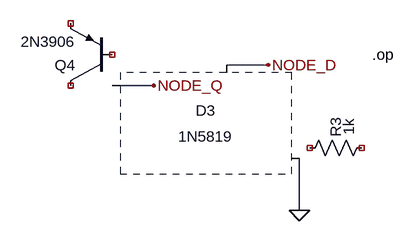
[diagram p0: schematic case_14.asc]
case_14.asc, the LTspice schematic file:
Version 4.1
SHEET 1 880 680
WIRE 272 192 336 192
WIRE 448 160 512 160
WIRE 560 304 560 384
FLAG 336 192 NODE_Q
FLAG 512 160 NODE_D
FLAG 560 384 0
SYMBOL pnp 272 192 R180
SYMATTR InstName Q4
SYMATTR Value 2N3906
SYMATTR Type pnp
SYMBOL Diodes\diode 448 160 M0
SYMATTR InstName D3
SYMATTR Value 1N5819
SYMATTR SpiceLine Ron=0.05
SYMBOL res 560 304 R270
WINDOW 0 32 56 Left 2
SYMATTR InstName R3
SYMATTR Value 1k
TEXT 672 144 Left 2 !.op

The netlist it stands for:
* case_14.asc
Q4 NC_01 NC_02 NC_03 0 2N3906
* D3: 1N5819 Ron=0.05 (symbol Diodes\diode not available, pin order unknown); nets seen at it: 0, NODE_D, NODE_Q
R3 NC_04 NC_05 1k
.model NPN NPN
.model PNP PNP
.lib standard.bjt
.op
.backanno
.end